# Altium schematic sheet DM2097_BOOT_AUX_uSD.SchDoc: =project_title
size Tabloid; CompanyName: Luxonis Holding; Organization: Luxonis Holding; Address1: 1925 Harmony Park Drive; Address2: Westminster, CO; Address3: 80234; Address4: United States; SheetNumber: 10; SheetTotal: 17
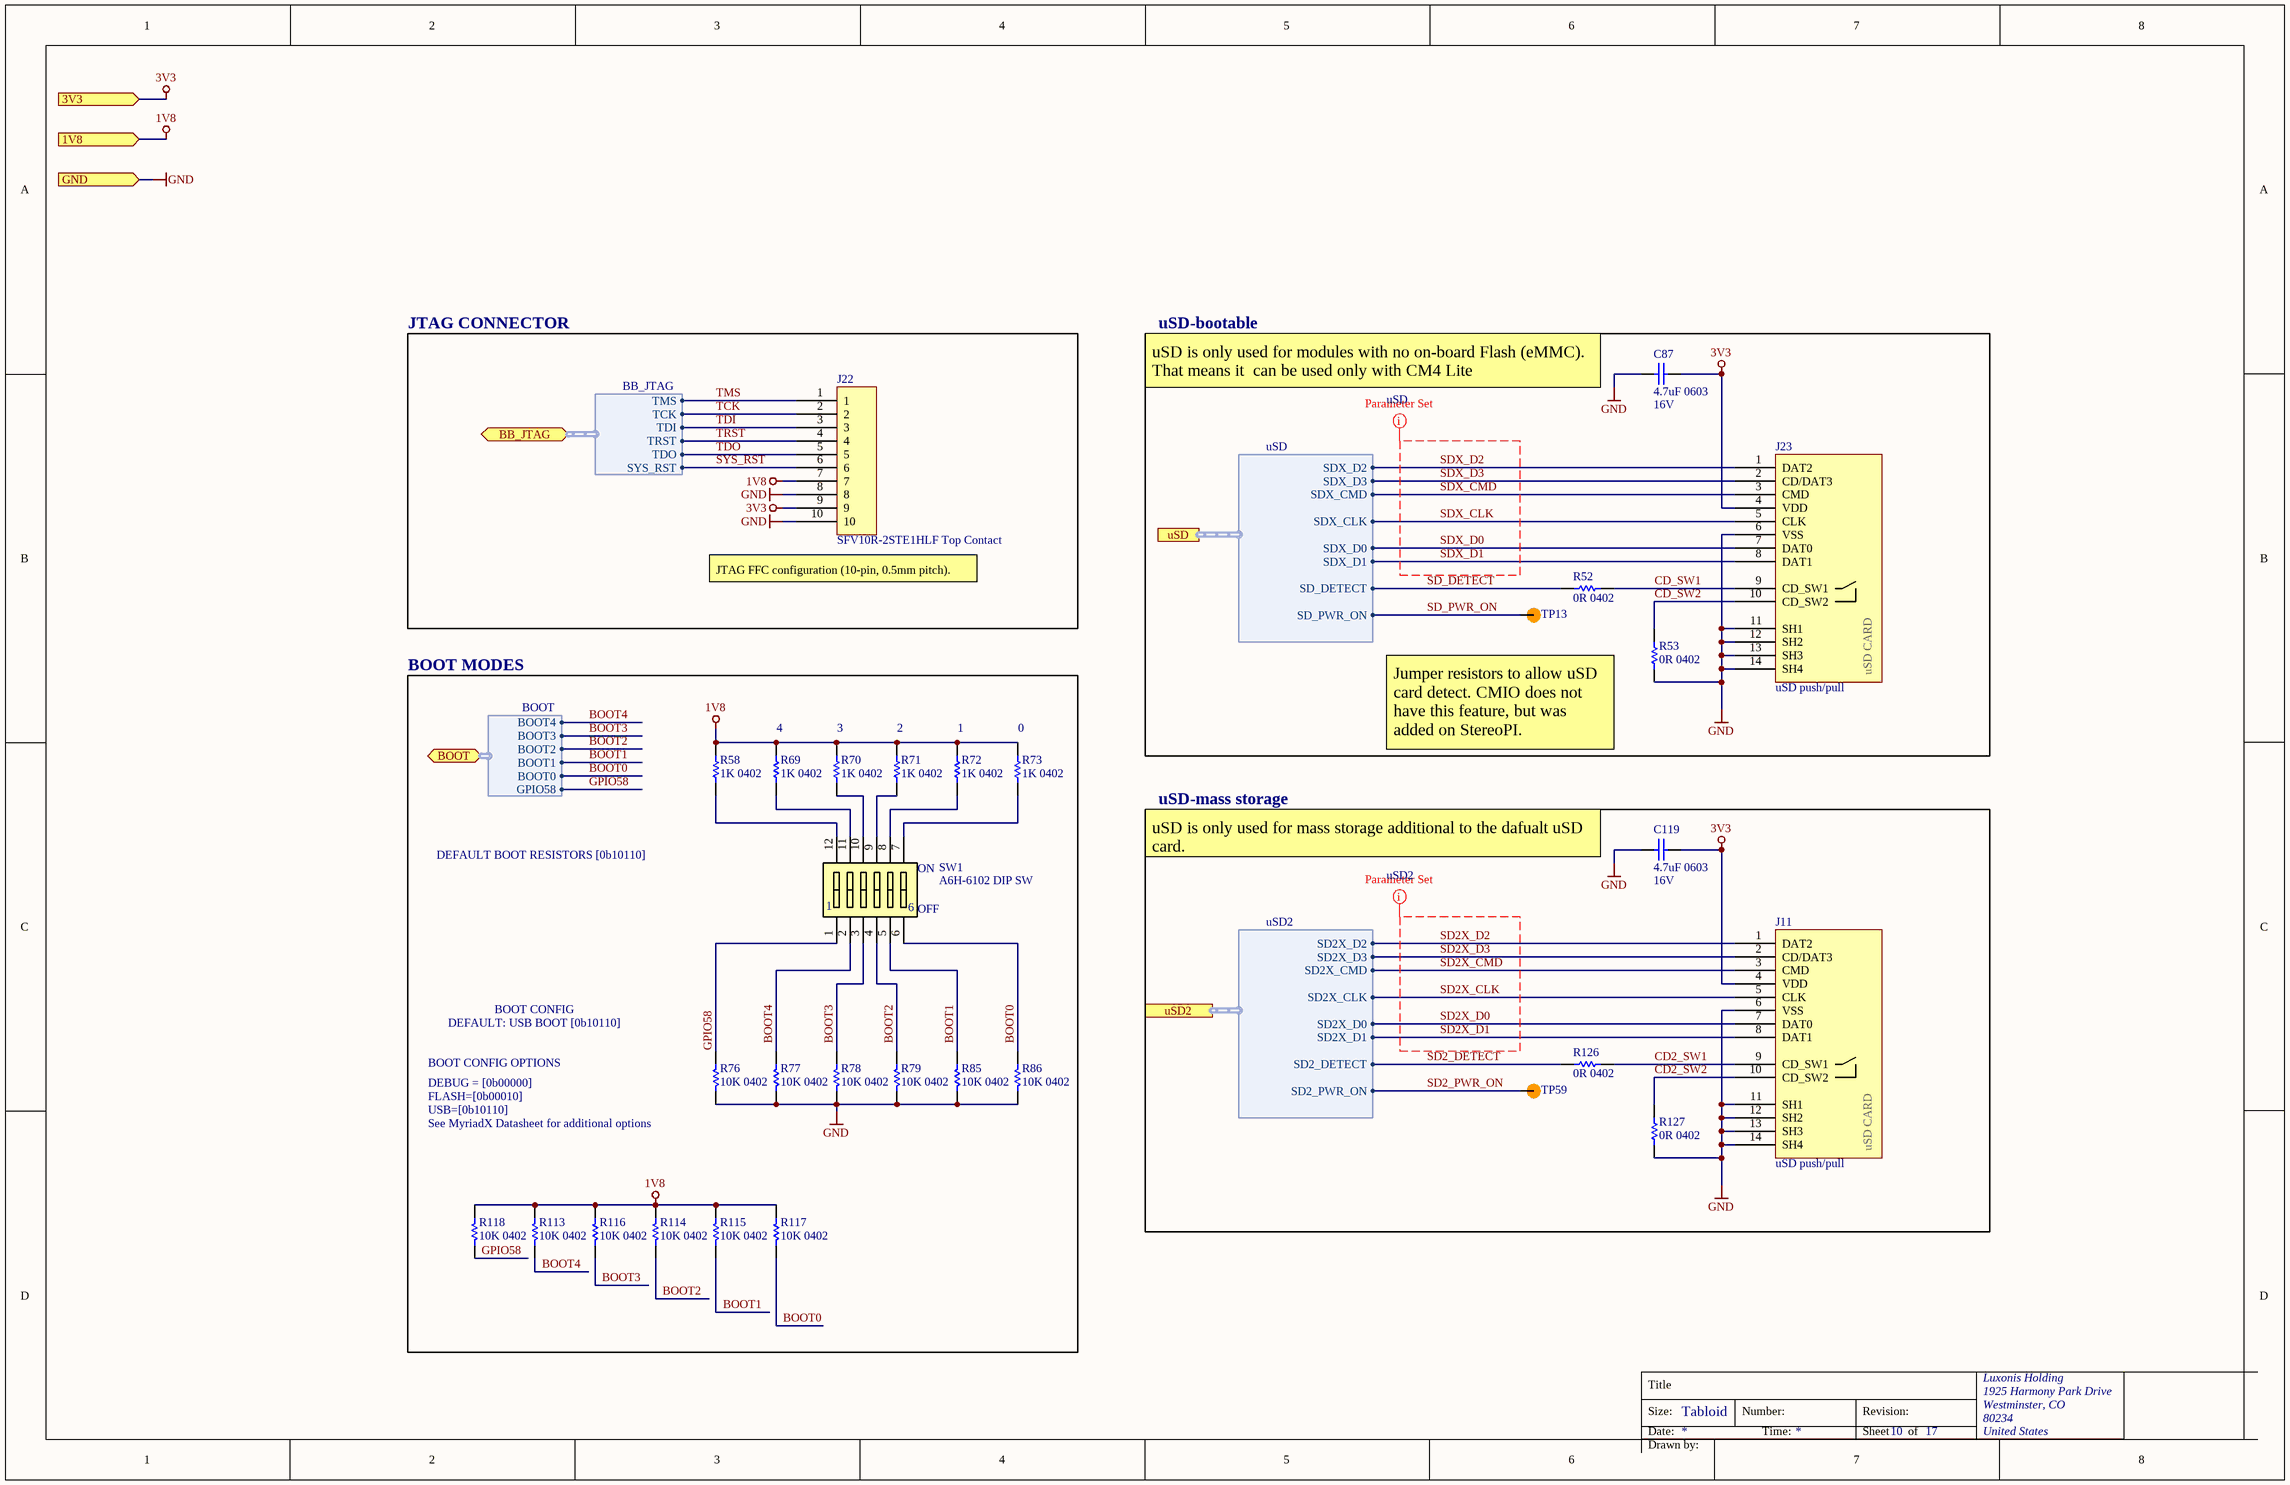
[diagram p0: DM2097_BOOT_AUX_uSD.SchDoc]

## Parts
C87  4.7uF 0603  Voltage Rating: 16V  [CAPC0603(1608)100_N]
C119  4.7uF 0603  Voltage Rating: 16V  [CAPC0603(1608)100_N]
J11  uSD push/pull  [104031-0811]
J22  SFV10R-2STE1HLF Top Contact  [SFV10R-2STE1HLF]
J23  uSD push/pull  [104031-0811]
R52  0R 0402  [RESC0402(1005)_N]
R53  0R 0402  [RESC0402(1005)_N]
R58  1K 0402  [RESC0402(1005)_N]
R69  1K 0402  [RESC0402(1005)_N]
R70  1K 0402  [RESC0402(1005)_N]
R71  1K 0402  [RESC0402(1005)_N]
R72  1K 0402  [RESC0402(1005)_N]
R73  1K 0402  [RESC0402(1005)_N]
R76  10K 0402  [RESC0402(1005)_N]
R77  10K 0402  [RESC0402(1005)_N]
R78  10K 0402  [RESC0402(1005)_N]
R79  10K 0402  [RESC0402(1005)_N]
R85  10K 0402  [RESC0402(1005)_N]
R86  10K 0402  [RESC0402(1005)_N]
R113  10K 0402  [RESC0402(1005)_N]
R114  10K 0402  [RESC0402(1005)_N]
R115  10K 0402  [RESC0402(1005)_N]
R116  10K 0402  [RESC0402(1005)_N]
R117  10K 0402  [RESC0402(1005)_N]
R118  10K 0402  [RESC0402(1005)_N]
R126  0R 0402  [RESC0402(1005)_N]
R127  0R 0402  [RESC0402(1005)_N]
SW1  A6H-6102 DIP SW  [A6H-610x]
TP13  TP100_200_NS  [TP100_200_NS]  (value not drawn)  (no BOM)
TP59  TP100_200_NS  [TP100_200_NS]  (value not drawn)  (no BOM)

## Blocks framed on the sheet
JTAG CONNECTOR: J22
uSD-bootable: C87 J23 R52 R53 TP13
BOOT MODES: R58 R69-R73 R76-R79 R85 R86 R113-R118 SW1
uSD-mass storage: C119 J11 R126 R127 TP59

## Ports
1V8 (in), 3V3 (in), BB_JTAG (bidir, harness BB_JTAG), BOOT (bidir, harness BOOT), GND (in), uSD2 (harness uSD2), uSD (harness uSD)

## Harnesses
uSD: SDX_D2, SDX_D3, SDX_CMD, SDX_CLK, SDX_D0, SDX_D1, SD_DETECT, SD_PWR_ON
BOOT: BOOT4, BOOT3, BOOT2, BOOT1, BOOT0, GPIO58
BB_JTAG: TMS, TCK, TDI, TRST, TDO, SYS_RST
uSD2: SD2X_D2, SD2X_D3, SD2X_CMD, SD2X_CLK, SD2X_D0, SD2X_D1, SD2_DETECT, SD2_PWR_ON

## Nets
1V8: J22.7 R58.2 R69.2 R70.2 R71.2 R72.2 R73.2 R113.1 R114.1 R115.1 R116.1 R117.1 R118.1 ; port 1V8
3V3: C87.2 C119.2 J11.4(VDD) J22.9 J23.4(VDD) ; port 3V3
GND: C87.1 C119.1 J11.6(VSS) J11.11(SH1) J11.12(SH2) J11.13(SH3) J11.14(SH4) J22.8 J22.10 J23.6(VSS) J23.11(SH1) J23.12(SH2) J23.13(SH3) J23.14(SH4) R53.1 R76.2 R77.2 R78.2 R79.2 R85.2 R86.2 R127.1 ; port GND
BOOT0: R86.1 R117.2 SW1.6 ; port BOOT.BOOT0
BOOT1: R85.1 R115.2 SW1.5 ; port BOOT.BOOT1
BOOT2: R79.1 R114.2 SW1.4 ; port BOOT.BOOT2
BOOT3: R78.1 R116.2 SW1.3 ; port BOOT.BOOT3
BOOT4: R77.1 R113.2 SW1.2 ; port BOOT.BOOT4
CD2_SW1: J11.9(CD_SW1) R126.1
CD2_SW2: J11.10(CD_SW2) R127.2
CD_SW1: J23.9(CD_SW1) R52.1
CD_SW2: J23.10(CD_SW2) R53.2
GPIO58: R76.1 R118.2 SW1.1 ; port BOOT.GPIO58
SD2_DETECT: R126.2 ; port uSD2.SD2_DETECT
SD2_PWR_ON: TP59.1 ; port uSD2.SD2_PWR_ON
SD2X_CLK: J11.5(CLK) ; port uSD2.SD2X_CLK
SD2X_CMD: J11.3(CMD) ; port uSD2.SD2X_CMD
SD2X_D0: J11.7(DAT0) ; port uSD2.SD2X_D0
SD2X_D1: J11.8(DAT1) ; port uSD2.SD2X_D1
SD2X_D2: J11.1(DAT2) ; port uSD2.SD2X_D2
SD2X_D3: J11.2(CD/DAT3) ; port uSD2.SD2X_D3
SD_DETECT: R52.2 ; port uSD.SD_DETECT
SD_PWR_ON: TP13.1 ; port uSD.SD_PWR_ON
SDX_CLK: J23.5(CLK) ; port uSD.SDX_CLK
SDX_CMD: J23.3(CMD) ; port uSD.SDX_CMD
SDX_D0: J23.7(DAT0) ; port uSD.SDX_D0
SDX_D1: J23.8(DAT1) ; port uSD.SDX_D1
SDX_D2: J23.1(DAT2) ; port uSD.SDX_D2
SDX_D3: J23.2(CD/DAT3) ; port uSD.SDX_D3
SYS_RST: J22.6 ; port BB_JTAG.SYS_RST
TCK: J22.2 ; port BB_JTAG.TCK
TDI: J22.3 ; port BB_JTAG.TDI
TDO: J22.5 ; port BB_JTAG.TDO
TMS: J22.1 ; port BB_JTAG.TMS
TRST: J22.4 ; port BB_JTAG.TRST
NetR58_1: R58.1 SW1.12
NetR69_1: R69.1 SW1.11
NetR70_1: R70.1 SW1.10
NetR71_1: R71.1 SW1.9
NetR72_1: R72.1 SW1.8
NetR73_1: R73.1 SW1.7

## Layout directives
net class uSD; rule Matched Net Lengths [Delay Tolerance = 10ps]: SDX_CLK, SDX_CMD, SDX_D0, SDX_D1, SDX_D2, SDX_D3
net class uSD2; rule Matched Net Lengths [Delay Tolerance = 10ps]: SD2X_CLK, SD2X_CMD, SD2X_D0, SD2X_D1, SD2X_D2, SD2X_D3

## Notes on the sheet
- uSD is only used for modules with no on-board Flash (eMMC).
  That means it  can be used only with CM4 Lite
- (near J22) JTAG FFC configuration (10-pin, 0.5mm pitch).
- (near R69) 4
- (near R70) 3
- (near R71) 2
- (near R72) 1
- (near R73) 0
- Jumper resistors to allow uSD card detect. CMIO does not have this feature, but was added on StereoPI.
- DEFAULT BOOT RESISTORS [0b10110]
- uSD is only used for mass storage additional to the dafualt uSD card.
- BOOT CONFIG
- DEFAULT: USB BOOT [0b10110]
- DEBUG = [0b00000]
- FLASH=[0b00010]
- BOOT CONFIG OPTIONS
- USB=[0b10110]
- (near R76) See MyriadX Datasheet for additional options
- Title
- Size:
- Date:
- Tabloid
- Number:
- Time:
- Revision:
- Sheet
- of
- Drawn by:
- (in symbol 104031-0811) uSD CARD
- (in symbol A6H-6102) ON; OFF

## Library data of the parts
C87 C119 = GRM188R61C475KAAJD: CAP CER 4.7UF 16V X5R 0603 10%; Manufacturer 1: Murata; Material: Ceramic; Manufacturer Part Number 1: GRM188R61C475KAAJD; Supplier 1: Digi-Key; Stock 1: 455058; Pricing 1: 1=0.35000, 10=0.24600, 100=0.14730, 500=0.11050, 1000=0.09331 (USD); RoHS: Yes; Mount: Surface Mount; Case/Package: 0603; Weight: 0.000222oz; Case Code (Metric): 1608; Case Code (Imperial): 0603; Min Operating Temperature: -55°C; Max Operating Temperature: 85°C; Capacitance: 4.7uF; Tolerance: 10%; Packaging: Tape and Reel; Dielectric: X5R; Termination: SMD/SMT; Voltage Rating (DC): 16V; Package Quantity: 4000; Length: 1.6mm; Height: 0.8mm; Width: 0.8mm; Thickness: 0.037inch; Depth: 0.8mm; REACH SVHC: No SVHC; Lead Free: Lead Free; ComponentLink1URL: https://datasheet.ciiva.com/14813/595grm188r61c475kaaj23-14813668.pdf?src-supplier=Arrow; ComponentLink1Description: https://datasheet.ciiva.com/14813/595grm188r61c475kaaj23-14813668.pdf?src-supplier=Arrow; Supplier 2: Digi-Key; Manufacturer 2: Murata; Manufacturer Part Number 2: GRM188R61C475KAAJD; Stock 2: 455058; Pricing 2: 1=0.35000, 10=0.24600, 100=0.14730, 500=0.11050, 1000=0.09331 (USD); Supplier 3: Digi-Key; Manufacturer 3: Murata; Manufacturer Part Number 3: GRM188R61C475KAAJD; Stock 3: 452000; Pricing 3: 4000=0.07259, 8000=0.06832, 12000=0.06619, 28000=0.06405 (USD); Supplier Part Number 1: 490-10481-1-ND; Supplier Part Number 2: 490-10481-6-ND; Supplier Part Number 3: 490-10481-2-ND
J11 J23 = 104031-0811: CONN MICRO SD CARD PUSH-PULL R/A; Manufacturer 1: Molex; Manufacturer Part Number 1: 104031-0811; Supplier 1: Digi-Key; Stock 1: 19400; Pricing 1: 1=2.02000, 10=1.82900, 25=1.71680, 50=1.64220, 100=1.56760, 250=1.41828, 500=1.30630, 1000=1.11969 (USD); RoHS: Yes; Supplier 2: Newark; Supplier 3: Mouser; Supplier Part Number 1: WM6357CT-ND; Supplier Part Number 2: 99R5410; Supplier Part Number 3: 538-104031-0811
J22 = SFV10R-2STE1HLF: CONN FFC TOP 10POS 0.50MM R/A; Manufacturer 1: Amphenol FCI; Actuator Material: Glass,Polyphenylene; Number of Contacts: 10; Current Rating: 500mA; Voltage Rating: 50V; Contact Resistance: 30mR; Insulation Resistance: 100MR; Gender: Female; Wire/Cable Type: Straight; Pitch: 0.5mm; System: Connector; Supplier 1: Digi-Key; Manufacturer Part Number 1: SFV10R-2STE1HLF; Stock 1: 78727; Pricing 1: 1=0.63000, 10=0.59300, 25=0.53360, 50=0.47420, 100=0.45440, 250=0.41488, 500=0.39512, 1000=0.32597 (USD); RoHS: Yes; Mount: Surface Mount; Contact Material: Bronze; Contact Plating: Tin; Housing Color: Black; Housing Material: Polyamide; Min Operating Temperature: -55°C; Max Operating Temperature: 105°C; Number of Rows: 1; Termination: Solder; Orientation: Right Angle; Package Quantity: 1; Packaging: Tape and Reel; Contact Location: Top; Number of Positions: 10; Max Voltage Rating (AC): 50V; Max Voltage Rating (DC): 50V; Length: 10.5mm; Depth: 4.9mm; Radiation Hardening: No; Lead Free: Lead Free; Flammability Rating: UL94 V-0; ComponentLink1URL: https://datasheet.ciiva.com/672/10112793-672039.pdf?src-supplier=Digi-Key; ComponentLink1Description: https://datasheet.ciiva.com/672/10112793-672039.pdf?src-supplier=Digi-Key; ComponentLink2URL: https://datasheet.ciiva.com/672/10112793-672040.pdf?src-supplier=Digi-Key; ComponentLink2Description: https://datasheet.ciiva.com/672/10112793-672040.pdf?src-supplier=Digi-Key; ComponentLink3URL: https://datasheet.ciiva.com/672/10112793-672041.pdf?src-supplier=Digi-Key; ComponentLink3Description: https://datasheet.ciiva.com/672/10112793-672041.pdf?src-supplier=Digi-Key; ComponentLink4URL: https://datasheet.ciiva.com/10368/10112793-10368361.pdf?src-supplier=Avnet; ComponentLink4Description: https://datasheet.ciiva.com/10368/10112793-10368361.pdf?src-supplier=Avnet; Supplier Part Number 1: 609-4306-1-ND; Supplier 2: Mouser; Supplier Part Number 2: 649-SFV10R-2STE1HLF
R52 R53 R126 R127 = CRCW04020000Z0ED: RES SMD 0 OHM JUMPER 1/16W 0402; Manufacturer 1: Vishay; Resistance: 0mR; Power Rating: 63mW; Voltage Rating: 50V; Temperature Coefficient: 100ppm/°C; Tolerance: 5%; Manufacturer Part Number 1: CRCW04020000Z0ED; Supplier 1: Digi-Key; Stock 1: 855968; Pricing 1: 1=0.10000, 10=0.03400, 25=0.02440, 50=0.01860, 100=0.01380, 250=0.01048, 500=0.00840, 1000=0.00618, 5000=0.00443 (USD); RoHS: Yes; Mount: Surface Mount; Case/Package: 0402; Weight: 2.3E-05oz; Case Code (Imperial): 0402; Case Code (Metric): 1005; Contact Plating: Tin; Min Operating Temperature: -55°C; Max Operating Temperature: 155°C; Packaging: Tape and Reel; Composition: Thick Film; Voltage Rating (DC): 50V; Package Quantity: 1; Termination: SMD/SMT; Number of Terminations: 2; Military Standard: Not; Max Power Dissipation: 63mW; Features: Automotive AEC-Q200; Length: 1mm; Height: 0.35mm; Width: 0.5mm; Depth: 0.5mm; Radiation Hardening: No; REACH SVHC: Unknown; Lead Free: Lead Free; ComponentLink1URL: https://datasheet.ciiva.com/3255/dcrcwe3-3255944.pdf?src-supplier=Avnet; ComponentLink1Description: https://datasheet.ciiva.com/3255/dcrcwe3-3255944.pdf?src-supplier=Avnet; ComponentLink2URL: https://datasheet.ciiva.com/3255/dcrcwe3-3255945.pdf?src-supplier=Avnet; ComponentLink2Description: https://datasheet.ciiva.com/3255/dcrcwe3-3255945.pdf?src-supplier=Avnet; ComponentLink3URL: https://datasheet.ciiva.com/16881/dcrcwe3-16881413.pdf?src-supplier=Avnet+Europe; ComponentLink3Description: https://datasheet.ciiva.com/16881/dcrcwe3-16881413.pdf?src-supplier=Avnet+Europe; ComponentLink4URL: https://datasheet.ciiva.com/2461/dcrcwe3-2461962.pdf?src-supplier=Digi-Key; ComponentLink4Description: https://datasheet.ciiva.com/2461/dcrcwe3-2461962.pdf?src-supplier=Digi-Key; ComponentLink5URL: https://datasheet.ciiva.com/7841/1720486-7841802.pdf?src-supplier=Element14; ComponentLink5Description: https://datasheet.ciiva.com/7841/1720486-7841802.pdf?src-supplier=Element14; ComponentLink6URL: https://datasheet.ciiva.com/2461/dcrcwe3-2461963.pdf?src-supplier=Digi-Key; ComponentLink6Description: https://datasheet.ciiva.com/2461/dcrcwe3-2461963.pdf?src-supplier=Digi-Key; ComponentLink7URL: https://datasheet.ciiva.com/2461/dcrcwe3-2461964.pdf?src-supplier=Digi-Key; ComponentLink7Description: https://datasheet.ciiva.com/2461/dcrcwe3-2461964.pdf?src-supplier=Digi-Key; ComponentLink8URL: https://datasheet.ciiva.com/7841/1697337-7841468.pdf?src-supplier=Element14; ComponentLink8Description: https://datasheet.ciiva.com/7841/1697337-7841468.pdf?src-supplier=Element14; ComponentLink9URL: https://datasheet.ciiva.com/16761/70200976-16761309.pdf?src-supplier=Allied+Electronics; ComponentLink9Description: https://datasheet.ciiva.com/16761/70200976-16761309.pdf?src-supplier=Allied+Electronics; ComponentLink10URL: https://datasheet.ciiva.com/26311/fld-crcw-e3-data-en-26311550.pdf?src-supplier=Distrelec; ComponentLink10Description: https://datasheet.ciiva.com/26311/fld-crcw-e3-data-en-26311550.pdf?src-supplier=Distrelec; Supplier Part Number 1: 541-0.0JCT-ND
R58 R69-R73 = RC0402FR-071KL: RES SMD 1K OHM 1% 1/16W 0402 1 kOhms ±1% 0.063W, 1/16W Chip Resistor 0402 (1005 Metric) Moisture Resistant Thick Film; Manufacturer 1: Yageo; Temperature Coefficient: 100ppm/°C; Power Rating: 62.5mW; Voltage Rating (DC): 50V; Resistance: 1kR; RoHS: Yes; Number of Pins: 2; Case Code (Imperial): 0402; Case Code (Metric): 1005; Min Operating Temperature: -55°C; Max Operating Temperature: 155°C; Packaging: Tape and Reel; Composition: Thick Film; Voltage Rating: 50V; Military Standard: Not; Termination: SMD/SMT; Length: 1mm; Height: 0.32mm; Width: 0.5mm; Depth: 0.5mm; Lead Free: Lead Free; REACH SVHC: Unknown; ComponentLink1URL: https://datasheet.ciiva.com/11819/0900766b80c66297-11819477.pdf?src-supplier=RSComponents; ComponentLink1Description: https://datasheet.ciiva.com/11819/0900766b80c66297-11819477.pdf?src-supplier=RSComponents; ComponentLink2URL: https://datasheet.ciiva.com/12666/pyu-rc0402-51-rohs-l-6-r-12666741.pdf?src-supplier=Mouser; ComponentLink2Description: https://datasheet.ciiva.com/12666/pyu-rc0402-51-rohs-l-6-r-12666741.pdf?src-supplier=Mouser; ComponentLink3URL: https://datasheet.ciiva.com/17063/pyu-rc0402-51-rohs-l-6-r-17063193.pdf?src-supplier=Future+Electronics; ComponentLink3Description: https://datasheet.ciiva.com/17063/pyu-rc0402-51-rohs-l-6-r-17063193.pdf?src-supplier=Future+Electronics; ComponentLink4URL: https://datasheet.ciiva.com/22747/1018594-22747513.pdf?src-supplier=Element14; ComponentLink4Description: https://datasheet.ciiva.com/22747/1018594-22747513.pdf?src-supplier=Element14; ComponentLink5URL: https://datasheet.ciiva.com/7849/1018594-7849869.pdf?src-supplier=Element14; ComponentLink5Description: https://datasheet.ciiva.com/7849/1018594-7849869.pdf?src-supplier=Element14; ComponentLink6URL: https://datasheet.ciiva.com/7983/1018594-7983502.pdf?src-supplier=Element14; ComponentLink6Description: https://datasheet.ciiva.com/7983/1018594-7983502.pdf?src-supplier=Element14; ComponentLink7URL: https://datasheet.ciiva.com/7849/1018594-7849871.pdf?src-supplier=Element14; ComponentLink7Description: https://datasheet.ciiva.com/7849/1018594-7849871.pdf?src-supplier=Element14; Supplier 1: Digi-Key; Manufacturer Part Number 1: RC0402FR-071KL; Stock 1: 60695854; Pricing 1: 1=0.10000, 10=0.01600, 100=0.00670, 1000=0.00301, 2500=0.00261, 5000=0.00215 (USD); Case/Package: 0402; Tolerance: 1%; Supplier Part Number 1: 311-1.00KLRCT-ND
R76-R79 R85 R86 R113-R118 = RC0402FR-1310KL: RES SMD 10K OHM 1% 0402 1/16W Chip Resistor, 0402 [1005 Metric], 10 kohm, RC Series, 50 V, Thick Film, 62.5 mW; Manufacturer 1: Yageo; Resistance: 10kR; Temperature Coefficient: 100ppm/°C; Power Rating: 62.5mW; Voltage Rating: 50V; ComponentLink1URL: https://datasheet.ciiva.com/16940/pyu-rc0402-51-rohs-l-6-16940293.pdf?src-supplier=Avnet+Europe; ComponentLink1Description: https://datasheet.ciiva.com/16940/pyu-rc0402-51-rohs-l-6-16940293.pdf?src-supplier=Avnet+Europe; ComponentLink2URL: https://datasheet.ciiva.com/28386/pyu-rc0402-51-rohs-l-6-28386855.pdf?src-supplier=Avnet+Europe; ComponentLink2Description: https://datasheet.ciiva.com/28386/pyu-rc0402-51-rohs-l-6-28386855.pdf?src-supplier=Avnet+Europe; ComponentLink3URL: https://datasheet.ciiva.com/16740/pyu-rc0402-51-rohs-l-6-r-16740602.pdf?src-supplier=Future+Electronics; ComponentLink3Description: https://datasheet.ciiva.com/16740/pyu-rc0402-51-rohs-l-6-r-16740602.pdf?src-supplier=Future+Electronics; ComponentLink4URL: https://datasheet.ciiva.com/8891/pyu-rc0402-51-rohs-l-6-8891339.pdf?src-supplier=Avnet; ComponentLink4Description: https://datasheet.ciiva.com/8891/pyu-rc0402-51-rohs-l-6-8891339.pdf?src-supplier=Avnet; ComponentLink5URL: https://datasheet.ciiva.com/5557/pyu-rc0402-51-rohs-l-6-r-5557997.pdf?src-supplier=Mouser; ComponentLink5Description: https://datasheet.ciiva.com/5557/pyu-rc0402-51-rohs-l-6-r-5557997.pdf?src-supplier=Mouser; ComponentLink6URL: https://datasheet.ciiva.com/7983/1018594-7983533.pdf?src-supplier=Element14; ComponentLink6Description: https://datasheet.ciiva.com/7983/1018594-7983533.pdf?src-supplier=Element14; Supplier 1: Newark; Manufacturer Part Number 1: RC0402FR-1310KL; Stock 1: 62239; Pricing 1: 1=0.10000, 25=0.01200, 100=0.00400, 250=0.00400, 500=0.00300, 1000=0.00300 (USD); RoHS: Yes; Case/Package: 0402; Number of Pins: 2; Contact Plating: Tin,Matte,Lead; Case Code (Imperial): 0402; Case Code (Metric): 1005; Min Operating Temperature: -55°C; Max Operating Temperature: 155°C; Tolerance: 1%; Composition: Thick Film; Packaging: Tape and Reel; Termination: SMD/SMT; Military Standard: Not; Voltage Rating (DC): 50V; Working Voltage: 50V; Number of Terminations: 2; Length: 1mm; Depth: 0.5mm; Radiation Hardening: No; REACH SVHC: No SVHC; Lead Free: Lead Free; Supplier Part Number 1: 67R9960; Supplier 2: Future Electronics; Supplier 3: Mouser; Supplier 4: Element14; Supplier Part Number 2: RC0402FR-1310KL-CUTT; Supplier Part Number 3: 603-RC0402FR-1310KL; Supplier Part Number 4: 1799235
SW1 = A6H-6102: SWITCH SLIDE DIP SPST 25MA 24V (SEALED); Manufacturer 1: Omron; Mechanical Life: 1000Cycles; Contact Resistance: 200mR; Number of Positions: 6; Actuator Type: Slide (Standard); Number of Poles: 4; Pitch: 0.05inch; Actuator Length: 0mm; Washable: Yes; Supplier 1: Digi-Key; Manufacturer Part Number 1: A6H-6102; Stock 1: 3953; Pricing 1: 1=2.66000, 10=2.57900, 25=2.44640, 50=2.28700, 100=2.23380, 250=1.91468, 500=1.86148, 1000=1.59555, 5000=1.46259 (USD); RoHS: Yes; Mount: Surface Mount; Case/Package: DIP; Weight: 0.12g; Min Operating Temperature: -20°C; Max Operating Temperature: 70°C; Voltage Rating (DC): 24V; Throw Configuration: SPST; Packaging: Rail/Tube; Max Current Rating: 25mA; Termination: Gull Wing; Orientation: Straight; Max Voltage Rating (DC): 24V; Current Rating: 25mA; Package Quantity: 54; Electrical Life: 1000Cycles; Number of Circuits: 6; Length: 0.348inch; Height: 1.55mm; Terminal Pitch: 1.27mm; Depth: 6.7mm; Width: 4.5mm; Radiation Hardening: No; REACH SVHC: Unknown; ComponentLink1URL: https://datasheet.ciiva.com/26883/getdatasheetpartid-744653-26883354.pdf?src-supplier=Verical; ComponentLink1Description: https://datasheet.ciiva.com/26883/getdatasheetpartid-744653-26883354.pdf?src-supplier=Verical; ComponentLink2URL: https://datasheet.ciiva.com/2864/a6h-1110-2864768.pdf?src-supplier=Digi-Key; ComponentLink2Description: https://datasheet.ciiva.com/2864/a6h-1110-2864768.pdf?src-supplier=Digi-Key; ComponentLink3URL: https://datasheet.ciiva.com/1529/611565-1529044.pdf?src-supplier=Element14; ComponentLink3Description: https://datasheet.ciiva.com/1529/611565-1529044.pdf?src-supplier=Element14; ComponentLink4URL: https://datasheet.ciiva.com/16198/a6h-1110-16198863.pdf?src-supplier=Onlinecomponents.com; ComponentLink4Description: https://datasheet.ciiva.com/16198/a6h-1110-16198863.pdf?src-supplier=Onlinecomponents.com; Supplier 2: Mouser; Supplier 3: Farnell; Supplier Part Number 2: 653-A6H-6102; Supplier Part Number 1: SW1117-ND; Supplier Part Number 3: 1829491
TP13 TP59 = TEST_POINT